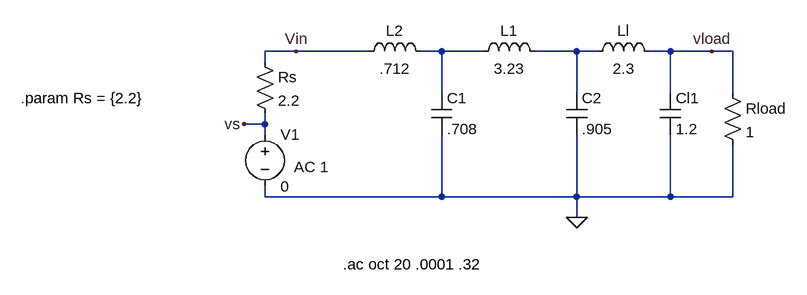
[diagram p0: schematic Example9_2_1.asc]
Example9_2_1.asc, the LTspice schematic file:
Version 4
SHEET 1 1424 680
WIRE 128 32 80 32
WIRE 240 32 128 32
WIRE 352 32 320 32
WIRE 416 32 352 32
WIRE 560 32 496 32
WIRE 592 32 560 32
WIRE 704 32 672 32
WIRE 768 32 704 32
WIRE 800 32 768 32
WIRE 80 48 80 32
WIRE 352 96 352 32
WIRE 560 96 560 32
WIRE 704 96 704 32
WIRE 800 96 800 32
WIRE 80 144 80 128
WIRE 80 144 48 144
WIRE 80 160 80 144
WIRE 80 256 80 240
WIRE 352 256 352 160
WIRE 352 256 80 256
WIRE 560 256 560 160
WIRE 560 256 352 256
WIRE 704 256 704 160
WIRE 704 256 560 256
WIRE 800 256 800 176
WIRE 800 256 704 256
WIRE 560 288 560 256
FLAG 128 32 Vin
FLAG 768 32 vload
FLAG 48 144 vs
FLAG 560 288 0
SYMBOL voltage 80 144 R0
WINDOW 123 45 66 Left 2
WINDOW 39 0 0 Left 2
SYMATTR Value2 AC 1
SYMATTR InstName V1
SYMATTR Value 0
SYMBOL res 64 32 R0
SYMATTR InstName Rs
SYMATTR Value 2.2
SYMBOL cap 336 96 R0
SYMATTR InstName C1
SYMATTR Value .708
SYMBOL ind 400 48 R270
WINDOW 0 32 56 VTop 2
WINDOW 3 5 56 VBottom 2
SYMATTR InstName L1
SYMATTR Value 3.23
SYMBOL cap 544 96 R0
SYMATTR InstName C2
SYMATTR Value .905
SYMBOL ind 576 48 R270
WINDOW 0 32 56 VTop 2
WINDOW 3 5 56 VBottom 2
SYMATTR InstName Ll
SYMATTR Value 2.3
SYMBOL cap 688 96 R0
SYMATTR InstName Cl1
SYMATTR Value 1.2
SYMBOL res 784 80 R0
SYMATTR InstName Rload
SYMATTR Value 1
SYMBOL ind 224 48 R270
WINDOW 0 32 56 VTop 2
WINDOW 3 5 56 VBottom 2
SYMATTR InstName L2
SYMATTR Value .712
TEXT 200 360 Left 2 !.ac oct 20 .0001 .32
TEXT -296 104 Left 2 !.param Rs = {2.2}

The netlist it stands for:
* Example9_2_1.asc
V1 vs 0 0 AC 1
Rs Vin vs 2.2
C1 N001 0 .708
L1 N001 N002 3.23
C2 N002 0 .905
Ll N002 vload 2.3
Cl1 vload 0 1.2
Rload vload 0 1
L2 Vin N001 .712
.ac oct 20 .0001 .32
.param Rs = {2.2}
.backanno
.end

* Results of the author's LTspice run, read from the files saved beside the schematic
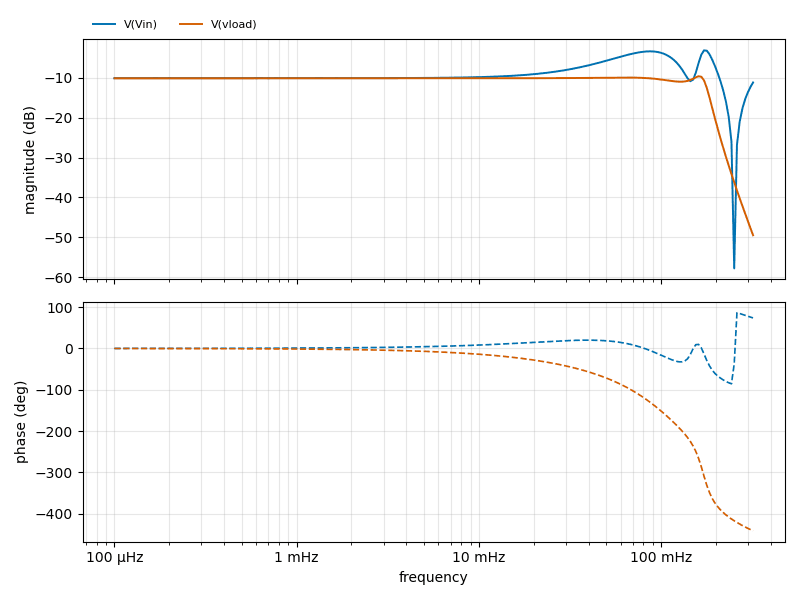
[diagram p1: AC Analysis of Example9_2_1.asc, plotted from the saved traces]
* AC Analysis, 1 run:
*   V(Vin): -10.09 dB at 100 µHz, -11.16 dB at 320 mHz, peak -3.09 dB at 172.2 mHz, 3 dB below the peak at 161.1 mHz and 193.7 mHz
*   V(vload): -10.11 dB at 100 µHz, -49.48 dB at 320 mHz, peak -9.59 dB at 160.7 mHz, 3 dB below the peak at 178.6 mHz